# EAGLE design NES (EAGLE 5.11)
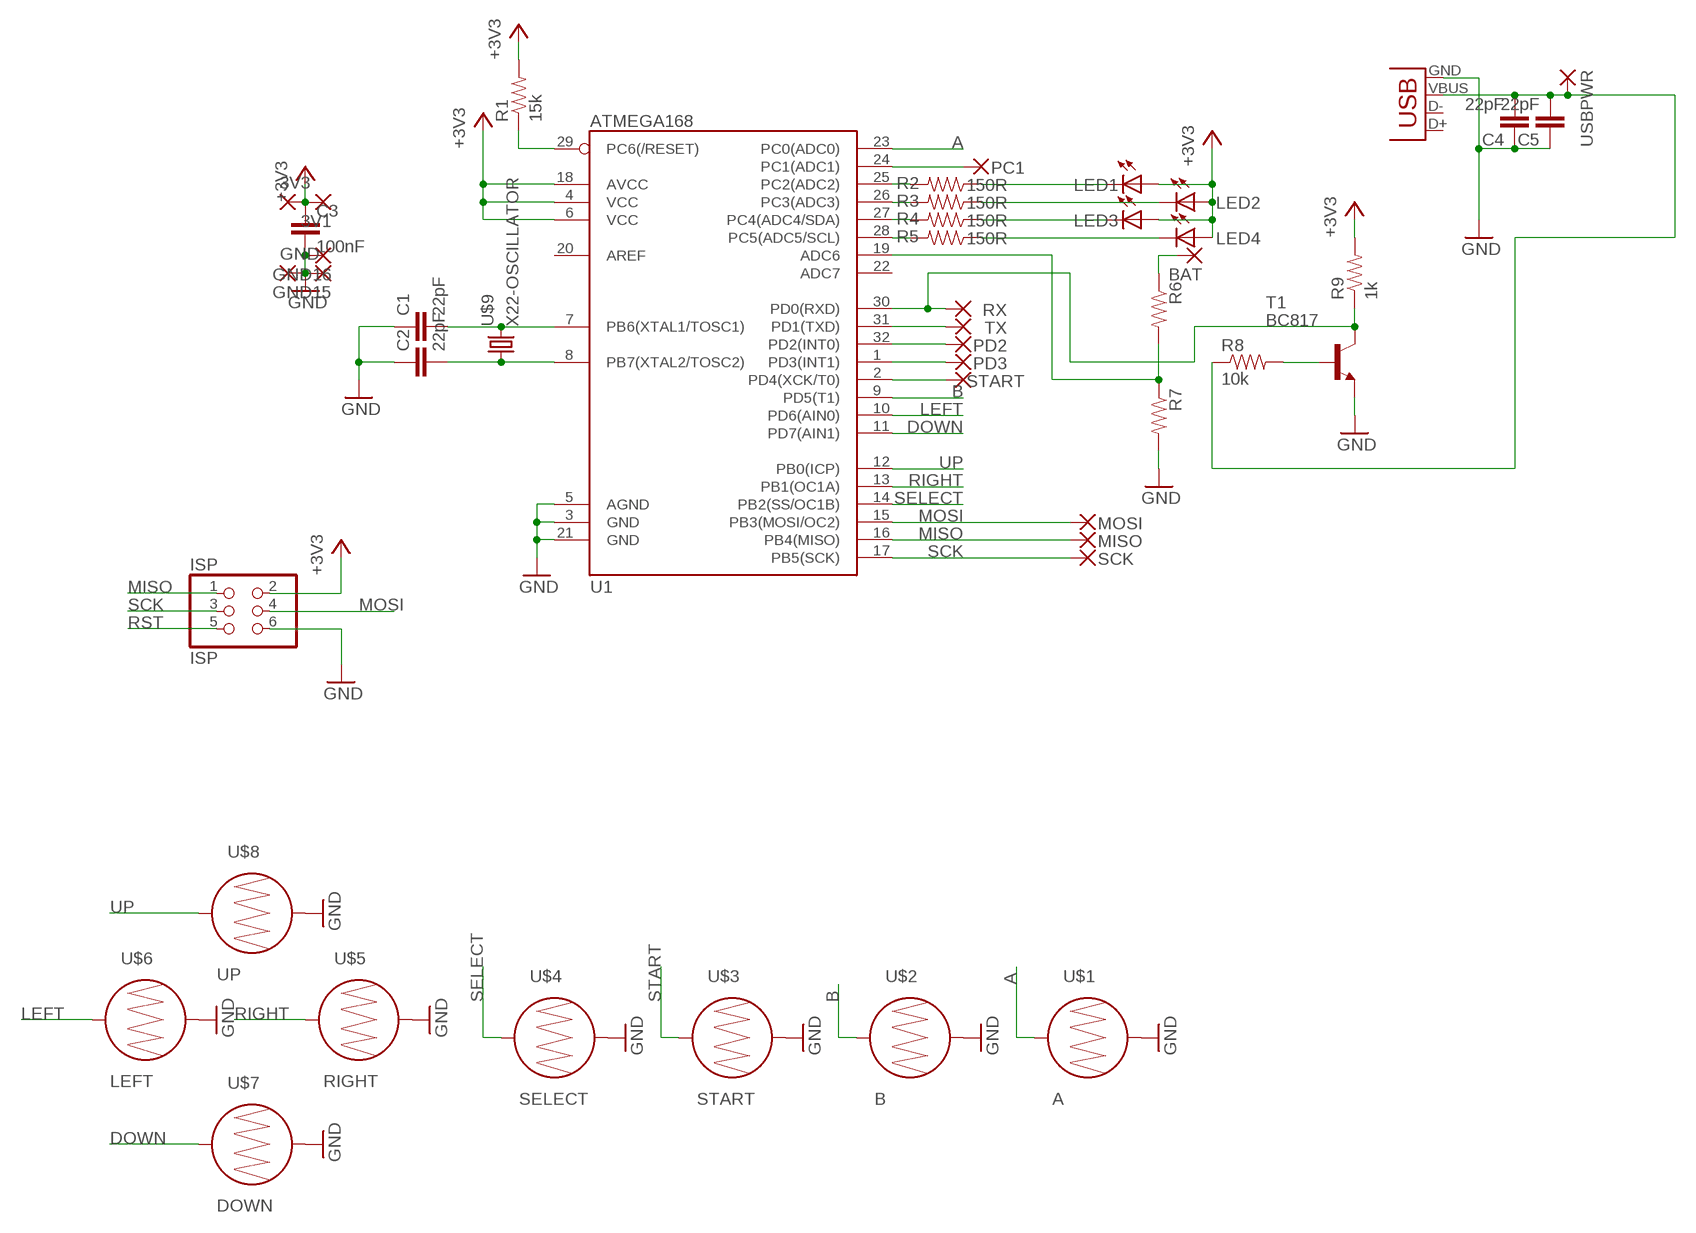
[diagram p0: schematic, sheet 1]

## Parts
3V1  SMD2  [SMD1,27-2,54]
3V3  SMD2  [SMD1,27-2,54]
BAT  SMD2  [SMD1,27-2,54]
C1  22pF  CAP0805  [0805]
C2  22pF  CAP0805  [0805]
C3  100nF  CAP0805  [0805]
C4  22pF  CAP0805  [0805]
C5  22pF  CAP0805  [0805]
GND  SMD2  [SMD1,27-2,54]
GND15  SMD2  [SMD1,27-2,54]
GND16  SMD2  [SMD1,27-2,54]
ISP  ISP  PINHD-2X03_2.54  [2X03]
LED1  LED3MM  [LED3MM]
LED2  LED3MM  [LED3MM]
LED3  LED3MM  [LED3MM]
LED4  LED3MM  [LED3MM]
MISO  SMD2  [SMD1,27-2,54]
MOSI  SMD2  [SMD1,27-2,54]
PC1  SMD2  [SMD1,27-2,54]
PD2  SMD2  [SMD1,27-2,54]
PD3  SMD2  [SMD1,27-2,54]
R1  15k  RESISTOR0805-RES  [0805]
R2  150R  RESISTOR0805-RES  [0805]
R3  150R  RESISTOR0805-RES  [0805]
R4  150R  RESISTOR0805-RES  [0805]
R5  150R  RESISTOR0805-RES  [0805]
R6  RESISTOR0805-RES  [0805]
R7  RESISTOR0805-RES  [0805]
R8  10k  RESISTOR0805-RES  [0805]
R9  1k  RESISTOR0805-RES  [0805]
RX  SMD2  [SMD1,27-2,54]
SCK  SMD2  [SMD1,27-2,54]
START  SMD2  [SMD1,27-2,54]
T1  BC817  BC847  [SOT23]
TX  SMD2  [SMD1,27-2,54]
U1  ATMEGA168  [TQFP32-08]
U$1  A  BUTTON-CONDUCTIVESMD  [BUTTON-CONDUCTIVE]
U$2  B  BUTTON-CONDUCTIVESMD  [BUTTON-CONDUCTIVE]
U$3  START  BUTTON-CONDUCTIVESMD  [BUTTON-CONDUCTIVE]
U$4  SELECT  BUTTON-CONDUCTIVESMD  [BUTTON-CONDUCTIVE]
U$5  RIGHT  BUTTON-CONDUCTIVESMD  [BUTTON-CONDUCTIVE]
U$6  LEFT  BUTTON-CONDUCTIVESMD  [BUTTON-CONDUCTIVE]
U$7  DOWN  BUTTON-CONDUCTIVESMD  [BUTTON-CONDUCTIVE]
U$8  UP  BUTTON-CONDUCTIVESMD  [BUTTON-CONDUCTIVE]
U$9  X22-OSCILLATOR  [X22]
USBPWR  SMD2  [SMD1,27-2,54]
X1  USB-SMD-NS  [USB-MINIB-NOSTOP]

## Nets
+3V3: 3V1.1(P) 3V3.1(P) C3.1 ISP.2 LED1.A LED2.A LED3.A LED4.A R1.2 R9.2 U1.4(VCC) U1.6(VCC) U1.18(AVCC)
+5V: C4.2 C5.2 R8.1 USBPWR.1(P) X1.VBUS
A: U1.23(PC0(ADC0)) U$1.1
B: U1.9(PD5(T1)) U$2.1
DOWN: U1.11(PD7(AIN1)) U$7.1
GND: C1.1 C2.1 C3.2 C4.1 C5.1 GND15.1(P) GND16.1(P) GND.1(P) ISP.6 R7.2 T1.2(E) U1.3(GND) U1.5(AGND) U1.21(GND) U$1.2 U$2.2 U$3.2 U$4.2 U$5.2 U$6.2 U$7.2 U$8.2 X1.GND
LEFT: U1.10(PD6(AIN0)) U$6.1
MISO: ISP.1 MISO.1(P) U1.16(PB4(MISO))
MOSI: ISP.4 MOSI.1(P) U1.15(PB3(MOSI/OC2))
N$1: PC1.1(P) U1.24(PC1(ADC1))
N$2: C2.2 U1.8(PB7(XTAL2/TOSC2)) U$9.1
N$3: C1.2 U1.7(PB6(XTAL1/TOSC1)) U$9.3
N$4: R5.2 U1.28(PC5(ADC5/SCL))
N$5: R4.2 U1.27(PC4(ADC4/SDA))
N$6: R3.2 U1.26(PC3(ADC3))
N$7: R2.2 U1.25(PC2(ADC2))
N$8: LED1.K(C) R2.1
N$9: LED2.K(C) R3.1
N$10: LED3.K(C) R4.1
N$11: LED4.K(C) R5.1
N$12: PD3.1(P) U1.1(PD3(INT1))
N$13: PD2.1(P) U1.32(PD2(INT0))
N$14: TX.1(P) U1.31(PD1(TXD))
N$16: BAT.1(P) R6.1
N$17: R6.2 R7.1 U1.19(ADC6)
N$18: R8.2 T1.1(B)
N$20: R9.1 RX.1(P) T1.3(C) U1.30(PD0(RXD))
RIGHT: U1.13(PB1(OC1A)) U$5.1
RST: ISP.5 R1.1 U1.29(PC6(/RESET))
SCK: ISP.3 SCK.1(P) U1.17(PB5(SCK))
SELECT: U1.14(PB2(SS/OC1B)) U$4.1
START: START.1(P) U1.2(PD4(XCK/T0)) U$3.1
UP: U1.12(PB0(ICP)) U$8.1
Unconnected: U1.20(AREF) U1.22(ADC7) X1.D+ X1.D-

## Library data of the parts
3V1 3V3 BAT GND GND15 GND16 MISO MOSI PC1 PD2 PD3 RX SCK START TX USBPWR = wirepad:SMD2: SMD PAD
C1-C5 = SparkFun:CAP: Capacitor Standard 0603 ceramic capacitor, and 0.1" leaded capacitor.
ISP = pinhead-2:PINHD-2X03: PIN HEADER
LED1-LED4 = SparkFun:LED: LEDs Standard schematic elements and footprints for 5mm, 3mm, 1206, and 0603 sized LEDs. 5mm - Spark Fun Electronics SKU : COM-00529 (and others)
R1-R9 = SparkFun:RESISTOR: Resistor Basic schematic elements and footprints for 0603, 1206, and PTH resistors.
T1 = transistor:BC847: NPN TRANSISTOR
U1 = SparkFun:ATMEGA168
U$1-U$8 = SparkFun:BUTTON-CONDUCTIVE: Conductive Button Used with rubber key pads. This one was designed and proven to work with the PolyCase Key FOB enclosures.
U$9 = seb:X22-OSCILLATOR
X1 = SparkFun:USB: USB Connectors USB-B-PTH is fully proven SKU : PRT-00139 USB-miniB is fully proven SKU : PRT-00587 USB-A-PCB is untested. USB-A-H is throughly reviewed, but untested. Spark Fun Electronics SKU : PRT-00437 USB-B-SMT is throughly reviewed, but untested. Needs silkscreen touching up. USB-A-S has not been used/tested USB-MB-H has not been used/tested

## Board
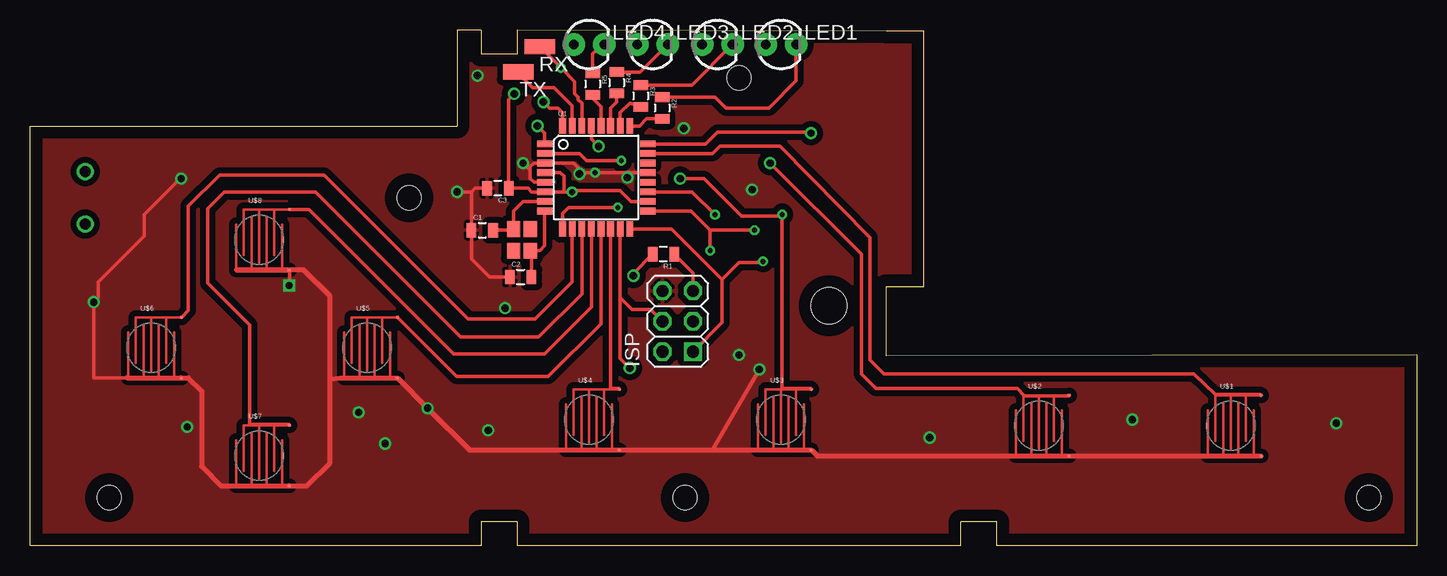
[diagram p1: board, top side]
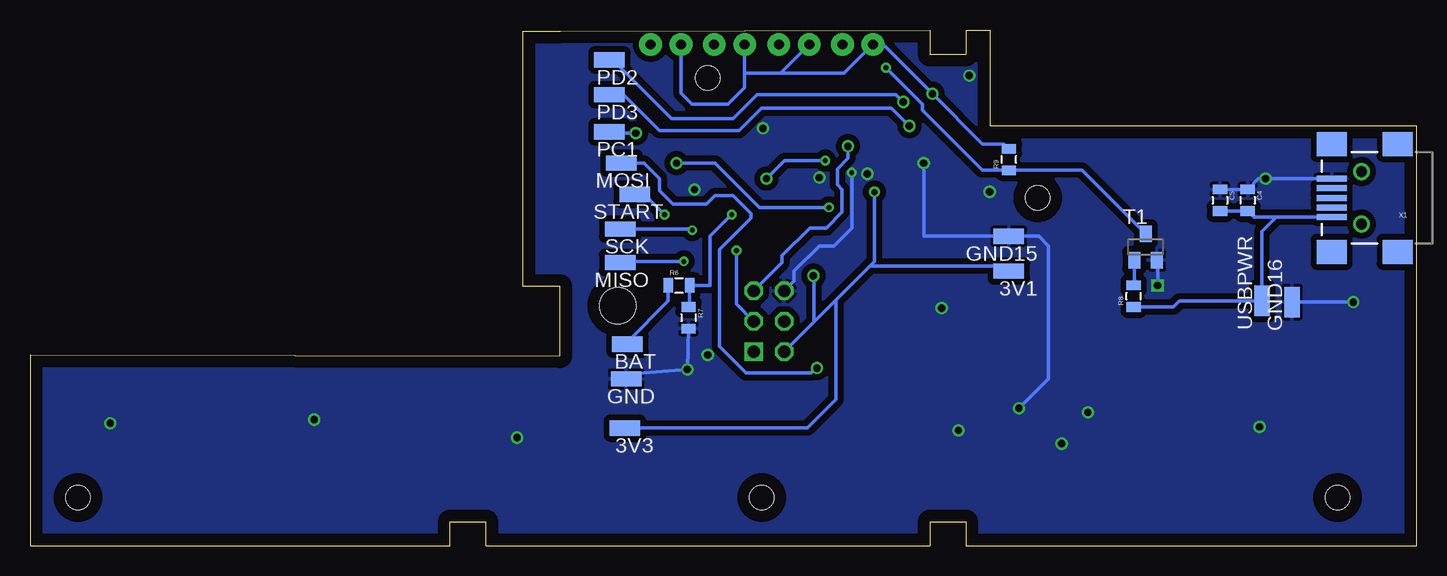
[diagram p2: board, bottom side, seen from below]

Size 115.6 x 43 mm. Coordinates in mm from the lower left corner, seen from the top.
Outline: 115.6,0 80.6,0 80.6,2 77.6,2 77.6,0 40.6,0 40.6,2 37.6,2 37.6,0 0,0 0,35 35.6,35 35.6,43 37.6,43 37.6,41 40.6,41 40.6,43 71.4,42.9 74.5,42.9 74.5,21.6 71.4,21.6 71.4,15.8 115.6,15.9 115.6,0
Copper layers (1*16): Top 0.035mm / dielectric 1.5mm / Bottom 0.035mm
Design rules "default *": minimum track width 10mil, minimum drill 0.3mm, track to track 8mil, track to pad 8mil, pad to pad 8mil, via to via 8mil, smd to smd 8mil, copper to edge 40mil, drill to drill 8mil, minimum pad ring 10mil, minimum via ring 8mil, stop-mask expansion 4mil, vias tented up to drill 0.6mm, thermal gap 10mil
Holes 2 mm at 111.6,4 54.6,4 6.6,4 59.1,39 31.6,29
Holes 3 mm at 66.6,20

### Footprints (pad centres in the part's own frame; a part is rotated, then mirrored left to right if it is on the bottom)
SMD1,27-2,54 = smd 1.27 x 2.54: 1 0,0
0805 = smd 0.8 x 1.2: 1 -0.9,0; 2 0.9,0
2X03 = drill 1.016 square: 1 -2.54,-1.27 | drill 1.016 octagon: 2 -2.54,1.27; 3 0,-1.27; 4 0,1.27; 5 2.54,-1.27; 6 2.54,1.27
LED3MM = drill 0.813 pad 1.88 round: A -1.27,0; K 1.27,0
SOT23 = smd 1 x 1.4: 1 -0.95,-1.1; 2 0.95,-1.1; 3 0,1.1
TQFP32-08 = smd 1.27 x 0.559: 1 -4.293,2.8; 2 -4.293,2; 3 -4.293,1.2; 4 -4.293,0.4; 5 -4.293,-0.4; 6 -4.293,-1.2; 7 -4.293,-2; 8 -4.293,-2.8; 17 4.293,-2.8; 18 4.293,-2; 19 4.293,-1.2; 20 4.293,-0.4; 21 4.293,0.4; 22 4.293,1.2; 23 4.293,2; 24 4.293,2.8 | smd 0.559 x 1.27: 9 -2.8,-4.293; 10 -2,-4.293; 11 -1.2,-4.293; 12 -0.4,-4.293; 13 0.4,-4.293; 14 1.2,-4.293; 15 2,-4.293; 16 2.8,-4.293; 25 2.8,4.293; 26 2,4.293; 27 1.2,4.293; 28 0.4,4.293; 29 -0.4,4.293; 30 -1.2,4.293; 31 -2,4.293; 32 -2.8,4.293
BUTTON-CONDUCTIVE = smd 0.203 x 0.203: 1 2.54,2.54; 2 2.54,-2.54
X22 = smd 1.3 x 1.1: 1 0.9,0.7; 2 -0.9,0.7; 3 -0.9,-0.7; 4 0.9,-0.7
USB-MINIB-NOSTOP = smd 2.5 x 0.5: D+ 2.5,0; D- 2.5,0.8; GND 2.5,-1.6; ID 2.5,-0.8; VBUS 2.5,1.6 | smd 2.5 x 2: G1 -3,-4.5; G2 -3,4.5; G3 2.5,4.5; G4 2.5,-4.5 | drill 0.9 pad 0.8 round: H1 0,2.2 | drill 0.9 pad 0.787 round: H2 0,-2.2

### Placement (x,y rotation side)
3V1  34,22.9 90 bottom
3V3  66,9.8 90 bottom
BAT  65.8,16.8 90 bottom
C1  37.7,26.3 0 top
C2  40.9,22.4 0 top
C3  39,29.8 180 top
C4  14.1,28.8 270 bottom
C5  16.4,28.8 270 bottom
GND  65.9,13.9 90 bottom
GND15  34,25.8 90 bottom
GND16  10.4,20.3 0 bottom
ISP  54,18.7 90 top
LED1  62.6,41.8 0 top
LED2  57.3,41.8 0 top
LED3  51.9,41.8 0 top
LED4  46.6,41.8 0 top
MISO  66.4,23.6 90 bottom
MOSI  66.3,31.9 90 bottom
PC1  67.3,34.5 90 bottom
PD2  67.3,40.5 90 bottom
PD3  67.3,37.6 90 bottom
R1  52.8,24.3 180 top
R2  52.7,36.5 270 top
R3  50.9,37.5 270 top
R4  48.9,38.6 270 top
R5  46.9,38.5 270 top
R6  61.5,21.7 0 bottom
R7  60.7,19 270 bottom
R8  23.6,20.8 90 bottom
R9  34,32.2 90 bottom
RX  42.5,41.6 90 top
SCK  66.4,26.4 90 bottom
START  65.2,29.3 90 bottom
T1  22.6,24.9 0 bottom
TX  40.7,39.5 90 top
U1  47.2,30.7 0 top
U$1  100.1,10 0 top
U$2  84.1,10 0 top
U$3  62.6,10.5 0 top
U$4  46.6,10.5 0 top
U$5  28.1,16.5 0 top
U$6  10.1,16.5 0 top
U$7  19.1,7.5 0 top
U$8  19.1,25.5 0 top
U$9  41,25.5 270 top
USBPWR  12.9,20.4 0 bottom
X1  4.6,29 180 bottom

### Tracks (layer width: path | path; a pad name or v marks a point on that pad's centre or on a via)
+3V3  (via drill 0.5, 0.6)
  Top 0.305: 44.5,29.5 U1.6 41.8,29.5 41.5,29.8 C3.1 39.9,37.2 v40.37,37.67 | 44.5,29.5 v45.2,29.5 45.3,29.6 49.2,29.6 50.1,28.7 U1.18 | U1.4 44.2,31.1 44.5,30.8 44.5,29.5 | R1.2 50.3,22.7 v50.3,22.5
  Bottom 0.305: LED1.A 61.33,37.73 60.4,36.8 57.4,36.8 56.03,38.17 56.03,39.4 | 56.03,39.4 LED2.A | 53.03,39.4 LED3.A | 53.03,39.4 56.03,39.4 | 53.03,39.4 47.73,39.4 LED4.A 44.5,41.8 v40.37,37.67 36.2,33.5 34.4,33.5 R9.2 | 50.24,18.64 ISP.2 | 48.4,20.5 50.24,18.64 | 45.59,23.3 48.4,20.5 | 45.59,23.3 45.2,23.69 v45.2,29.5 | v50.3,22.5 50.24,22.45 50.24,18.64 | 3V3.1 50.8,9.8 48.4,12.21 48.4,20.5 | 3V1.1 34.39,23.3 45.59,23.3
+5V
  Bottom 0.305: R8.1 20.3,19.9 19.8,20.4 USBPWR.1 12.9,26.2 11.7,27.4 | X1.VBUS 11.7,27.4 | C5.2 C4.2 13.6,27.4 11.7,27.4
A
  Top 0.305: U$1.1 102.58,12.6 98.8,12.6 97,14.3 71.2,14.3 70,15.5 70,25.7 62.5,33.3 57.5,33.3 56.9,32.7 U1.23
B  (via drill 0.4, 0.6)
  Top 0.305: U$2.1 86.6,12.5 82.9,12.5 82.3,13.1 70.5,13.1 69.3,14.3 69.3,24.3 v61.7,31.9 | U1.9 44.4,27.7 44.9,28.2 v49,28.2
  Bottom 0.305: v49,28.2 54.8,28.2 58.5,31.9 v61.7,31.9
DOWN
  Top 0.305: U1.11 46,21 42.4,17.4 35.9,17.4 23.8,29.5 16.2,29.5 14.8,28.1 14.8,21.9 18.3,18.4 18.3,10.1 21.58,10.1 U$7.1
GND  (via drill 0.4, 0.6)
  Top 0.305: U1.5 42,30.3 41.7,30.6 41.7,31.3 | 41.7,31.3 41.7,31.6 42,31.9 U1.3 45.3,31.9 46.1,31.1 v47.1,31.1 U1.21 | C2.1 38.3,22.4 36.8,23.9 C1.1 36.8,29.5 | 36.8,29.5 37.1,29.8 C3.2 | v41.1,31.9 41.7,31.3 | 56.9,7.96 v60.8,14.7 | v21.6,21.7 21.64,21.7 U$8.2 | 8.1,14 5.3,14 v5.3,20.3 5.7,20.7 5.7,22 9.5,25.8 9.5,27.6 12.5,30.6 v12.6,30.6 | 36.8,29.5 v35.6,29.5
  Top 0.406: U$1.2 U$2.2 65.64,7.46 U$3.2 56.9,7.96 U$4.2 36.64,7.96 v33.15,11.45 U$5.2 25.86,13.96 25,13.9 | 25,13.9 25,6.9 23.06,4.96 U$7.2 21.6,5 15.9,5 14.3,6.6 14.3,12.9 13.2,14 12.6,14 | 12.6,14 U$6.2 | 8.1,14 12.6,14 | U$8.2 17.24,22.96 17.2,23 22.8,23 25,20.8 25,13.9
  Bottom 0.305: v41.1,31.9 41.1,25.8 GND15.1 31.5,25.8 30.7,25 30.7,13.9 v33.15,11.45 | ISP.6 51.9,22.07 51.9,22.9 49.8,25 48.6,25 47.1,26.5 v47.1,31.1 | R7.2 v60.8,14.7 65.5,14.3 GND.1 | v5.3,20.3 GND16.1 | X1.GND v12.6,30.6 13.2,30.6 C4.1 C5.1 | T1.2 21.6,23.75 v21.6,21.7
  other vias: 39.6,19.8 27.4,11.1 38.2,9.6 29.6,8.5 13.1,9.9 59.1,15.9 60.2,29.7 54.5,34.8 45.8,31 49.8,30.7 75,9 91.9,10.5 108.9,10.2 37.3,39.2
  pour Bottom (isolate 0.5): -0.3,0.1 -0.3,42.8 115.6,42.8 115.6,0.1
  pour Top (isolate 0.5): -0.3,-0.1 -0.3,42.8 115.6,42.9 115.6,0
LEFT
  Top 0.305: U1.10 45.2,22 42.1,18.9 36.5,18.9 24.5,30.9 15.8,30.9 13.2,28.3 13.2,19.6 U$6.1
MISO  (via drill 0.4)
  Top 0.305: U1.16 53.49,26.41 57.7,22.2 | 57.7,22.2 57.7,18.59 ISP.1 | 57.7,22.2 59.1,23.6 61,23.6 v61.1,23.7
  Bottom 0.305: v61.1,23.7 66.3,23.7 MISO.1
MOSI  (via drill 0.6)
  Top 0.305: ISP.4 51.73,19.7 50.2,19.7 49.2,20.7 | 49.2,20.7 U1.15 | v50,14.8 49.2,15.6 49.2,20.7
  Bottom 0.305: v50,14.8 50.5,14.4 55.9,14.4 58.1,16.6 58.1,24.7 55.5,27.3 55.5,27.7 57,29.2 58.5,29.2 59.2,28.5 62,28.5 63.1,29.6 63.1,30.6 64.4,31.9 MOSI.1
N$1  (via drill 0.6)
  Top 0.305: U1.24 56.3,33.5 57.3,34.5 64.9,34.5 v65.1,34.4
  Bottom 0.305: v65.1,34.4 66.5,34.4 PC1.1
N$2
  Top 0.305: U1.8 42.91,25.01 42.5,24.6 U$9.1 41.8,24.5 C2.2
N$3
  Top 0.305: U1.7 41.1,28.7 40.3,27.9 U$9.3 40.2,26.3 C1.2
N$4
  Top 0.305: U1.28 47.6,36.6 46.9,37.3 R5.2
N$5
  Top 0.305: U1.27 48.4,36.5 48.9,37 R4.2
N$6
  Top 0.305: U1.26 49.2,36.1 50,36.9 R3.2
N$7
  Top 0.305: U1.25 50.79,34.99 51.4,35.6 R2.2
N$8
  Top 0.305: R2.1 57.1,37.4 58,36.5 61.6,36.5 63.87,38.77 LED1.K
N$9
  Top 0.305: R3.1 55.17,38.4 LED2.K
N$10
  Top 0.305: R4.1 50.87,39.5 LED3.K
N$11
  Top 0.305: R5.1 46.9,41.03 LED4.K
N$12  (via drill 0.6)
  Top 0.305: v42.3,35 42.91,34.39 U1.1
  Bottom 0.305: 42.3,34.9 v42.3,35 43.8,36.5 54.6,36.5 56.5,34.6 63.1,34.6 66.1,37.6 PD3.1
N$13  (via drill 0.6)
  Top 0.305: v42.8,37 43.3,36.5 44,36.5 44.4,36.1 U1.32
  Bottom 0.305: v42.8,37 43.4,37.6 55,37.6 57,35.6 62.1,35.6 67,40.5 PD2.1
N$14
  Top 0.305: U1.31 45.2,36.7 43.7,38.2 41.9,38.2 40.6,39.5 TX.1
N$16
  Bottom 0.305: BAT.1 65.8,17 62.4,20.4 R6.1
N$17  (via drill 0.4)
  Top 0.305: v57.1,27.6 55.2,29.5 U1.19
  Bottom 0.305: v57.1,27.6 58.9,25.8 58.9,21.7 R6.2 60.6,20 R7.1
N$18
  Bottom 0.305: R8.2 23.55,21.75 T1.1
N$20  (via drill 0.4)
  Top 0.305: RX.1 v44.25,39.85 44.3,39.8 45.4,38.7 45.4,37.7 45.7,37.4 45.7,37.2 46,36.9 U1.30
  Bottom 0.305: T1.3 27.9,31.3 R9.1 36.2,31.3 41.2,36.3 41.2,36.8 v44.25,39.85
RIGHT
  Top 0.305: U1.13 47.6,18.5 43.2,14.1 35.58,14.1 U$5.1
RST  (via drill 0.6)
  Top 0.305: 46.9,34.89 U1.29 46.8,33.9 v47.4,33.3 | R1.1 55.27,22.73 ISP.5
  Bottom 0.305: v47.4,33.3 47.4,32.3 48.3,31.4 48.3,30.1 47.9,29.7 47.9,27.8 49.2,26.5 50.6,26.5 52.91,24.19 52.91,23.6 ISP.5
SCK  (via drill 0.4)
  Top 0.305: 56.7,26.3 55.1,27.9 U1.17 | v56.7,24.6 56.7,26.3 | 56.7,26.3 v60.4,26.3
  Bottom 0.305: ISP.3 56.7,20.13 v56.7,24.6 | SCK.1 60.5,26.4 v60.4,26.3
SELECT
  Top 0.305: U1.14 48.4,13.1 49.08,13.1 U$4.1
START  (via drill 0.4, 0.6)
  Top 0.305: U$3.1 65.08,13.1 62.7,13.1 v62.7,27.6 62.6,27.5 59.3,27.5 56.2,30.6 v54.2,30.6 | U1.2 45.8,32.7 46.4,32.1 v49.3,32.1
  Bottom 0.305: v54.2,30.6 52.7,32.1 v49.3,32.1 | START.1 64.4,29.3 v62.7,27.6
UP
  Top 0.305: U1.12 46.8,19.9 42.9,16 35.3,16 23.26,28.04 U$8.1

### Text on the board
bStop: PD2 | PD3 | PC1 | MOSI | START | SCK | GND | MISO | 3V3 | GND | USB5V | BAT | PentaWall GamePad v0.1 | GND | 3V3 | seb@exse.net | <<</>>